# EAGLE design hc_05 (EAGLE 9.6.1)
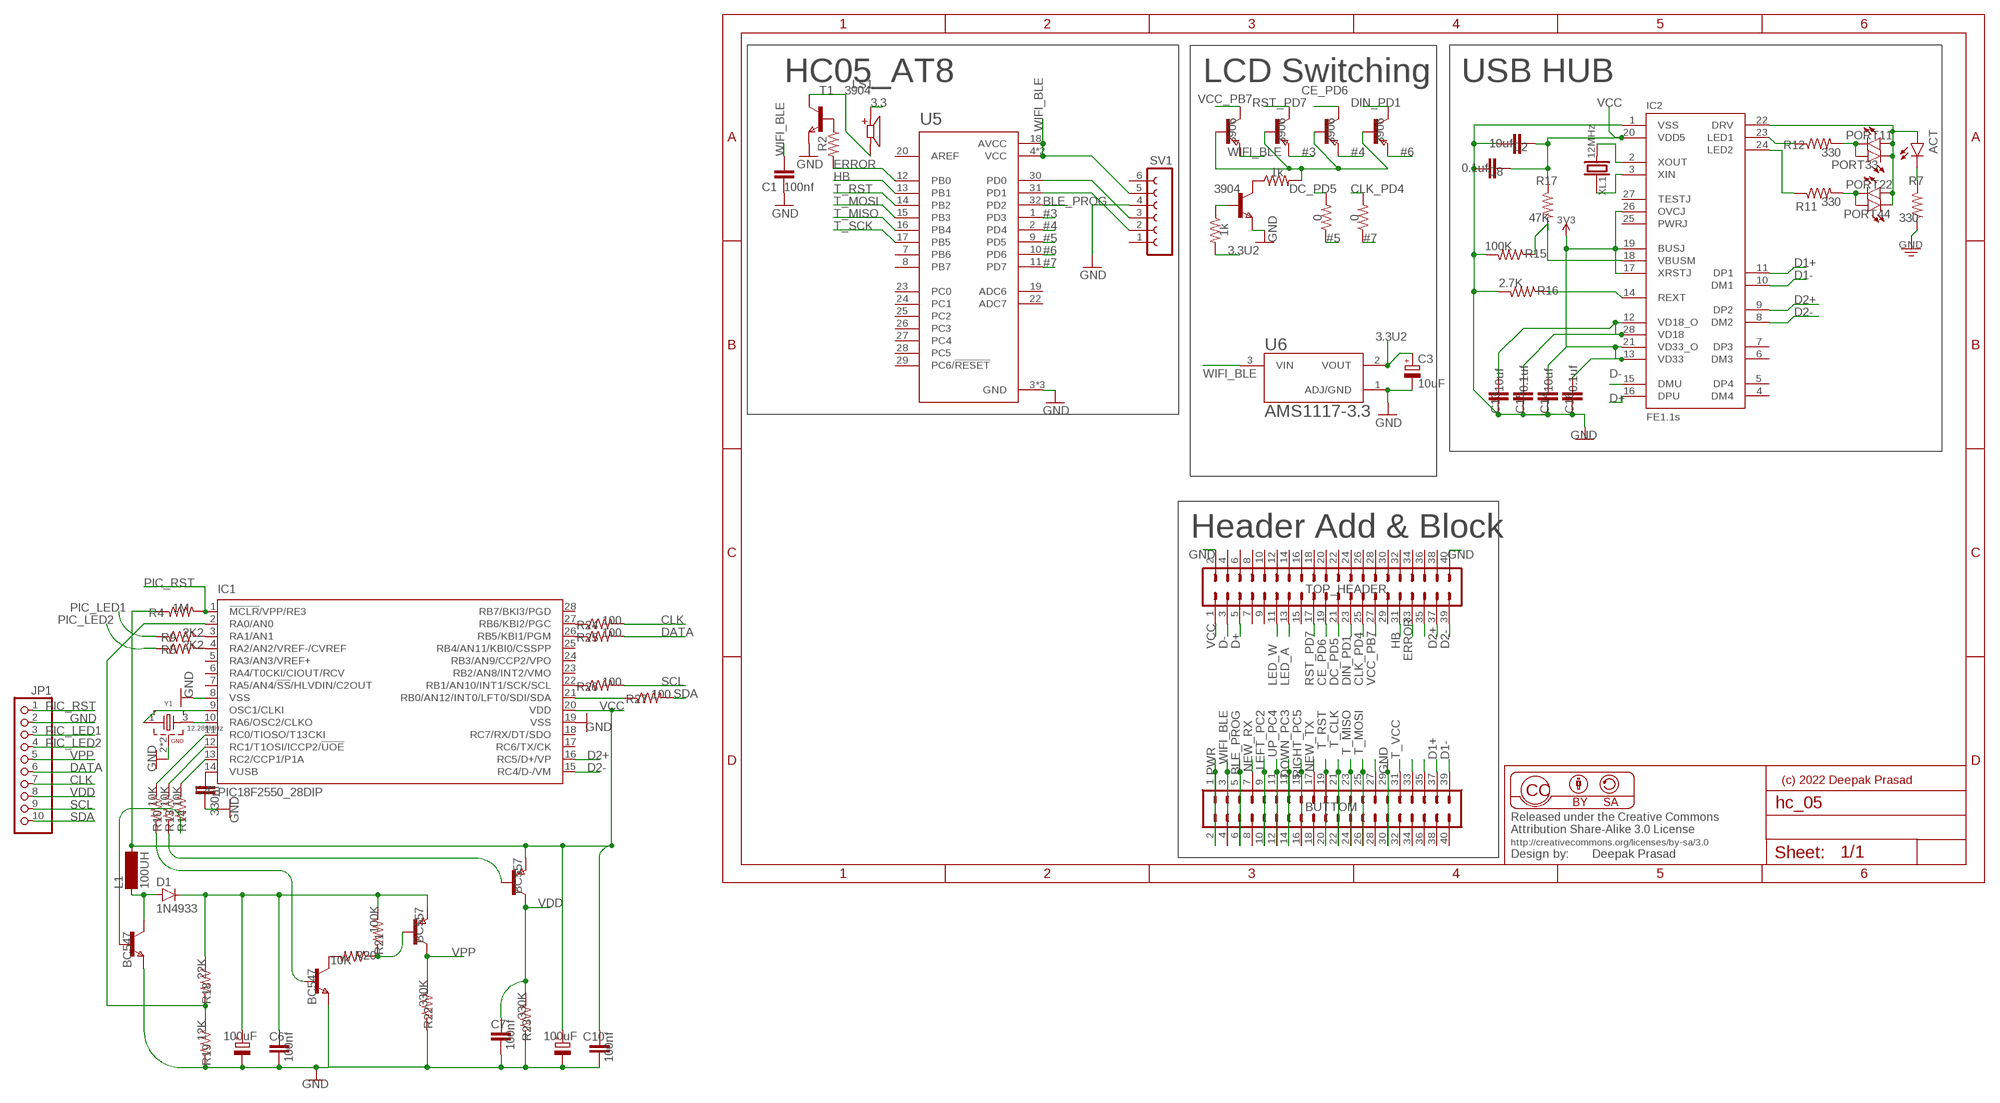
[diagram p0: schematic, sheet 1]

## Parts
ACT  LED1206  [LED-1206]
BUTTOM  MA20-2  [MA20-2]
C1  100nf  C-EUC1206  [C1206]
C2  10uf  C-EUC1206  [C1206]
C3  10uF  CPOL-EUC/6032-28R  [C/6032-28R]
C4  330nf  C-EUC1206  [C1206]
C5  100uF  CPOL-EUC/6032-28R  [C/6032-28R]
C6  100nf  C-EUC1206  [C1206]
C7  100nf  C-EUC1206  [C1206]
C8  0.1uf  C-EUC1206  [C1206]
C9  100uF  CPOL-EUC/6032-28R  [C/6032-28R]
C10  100nf  C-EUC1206  [C1206]
C13  10uf  C-EUC1206  [C1206]
C14  10uf  C-EUC1206  [C1206]
C15  0.1uf  C-EUC1206  [C1206]
C16  0.1uf  C-EUC1206  [C1206]
D1  1N4933  D-SMB  [SMB]
IC1  PIC18F2550_28DIP  [DIL28-3]
IC2  FE1.1S  [FE1.1S_SSOP-28]
JP1  PINHD-1X10  [1X10]
L1  100UH  MS85  [MS85]
LS1  CMT-8530S-SMT  [CUI_CMT-8530S-SMT]
PORT11  LED1206  [LED-1206]
PORT22  LED1206  [LED-1206]
PORT33  LED1206  [LED-1206]
PORT44  LED1206  [LED-1206]
R1  1k  R-US_CHIP-1206(3216-METRIC)  [RESC3216X70]
R2  22  R-US_CHIP-1206(3216-METRIC)  [RESC3216X70]
R3  0  R-US_CHIP-1206(3216-METRIC)  [RESC3216X70]
R4  1M  R-US_CHIP-1206(3216-METRIC)  [RESC3216X70]
R5  2K2  R-US_CHIP-1206(3216-METRIC)  [RESC3216X70]
R6  1k  R-US_CHIP-1206(3216-METRIC)  [RESC3216X70]
R7  330  R-US_CHIP-1206(3216-METRIC)  [RESC3216X70]
R8  0  R-US_CHIP-1206(3216-METRIC)  [RESC3216X70]
R9  2K2  R-US_CHIP-1206(3216-METRIC)  [RESC3216X70]
R10  10K  R-US_CHIP-1206(3216-METRIC)  [RESC3216X70]
R11  330  R-US_CHIP-1206(3216-METRIC)  [RESC3216X70]
R12  330  R-US_CHIP-1206(3216-METRIC)  [RESC3216X70]
R13  10K  R-US_CHIP-1206(3216-METRIC)  [RESC3216X70]
R14  10K  R-US_CHIP-1206(3216-METRIC)  [RESC3216X70]
R15  100K  R-US_CHIP-1206(3216-METRIC)  [RESC3216X70]
R16  2.7K  R-US_CHIP-1206(3216-METRIC)  [RESC3216X70]
R17  47K  R-US_CHIP-1206(3216-METRIC)  [RESC3216X70]
R18  22K  R-US_CHIP-1206(3216-METRIC)  [RESC3216X70]
R19  12K  R-US_CHIP-1206(3216-METRIC)  [RESC3216X70]
R20  10K  R-US_CHIP-1206(3216-METRIC)  [RESC3216X70]
R21  100K  R-US_CHIP-1206(3216-METRIC)  [RESC3216X70]
R22  330K  R-US_CHIP-1206(3216-METRIC)  [RESC3216X70]
R23  330K  R-US_CHIP-1206(3216-METRIC)  [RESC3216X70]
R24  100  R-US_CHIP-1206(3216-METRIC)  [RESC3216X70]
R25  100  R-US_CHIP-1206(3216-METRIC)  [RESC3216X70]
R26  100  R-US_CHIP-1206(3216-METRIC)  [RESC3216X70]
R27  100  R-US_CHIP-1206(3216-METRIC)  [RESC3216X70]
SV1  FE06-1  [FE06]
T1  3904  NPNSOT23  [SOT-23]
T2  3904  NPNSOT23  [SOT-23]
T3  3906  PNPSOT23  [SOT-23]
T4  3906  PNPSOT23  [SOT-23]
T5  3906  PNPSOT23  [SOT-23]
T6  3906  PNPSOT23  [SOT-23]
T7  BC547  NPNSOT23  [SOT-23]
T8  BC557  PNPSOT23  [SOT-23]
T9  BC547  NPNSOT23  [SOT-23]
T10  BC557  PNPSOT23  [SOT-23]
TOP_HEADER  MA20-2  [MA20-2]
U5  ATMEGA328P-AU  [QFP80P900X900X120-32N]
U6  AMS1117-3.3  [SOT229P700X180-4N]
XL1  12MHz  CRYSTALHC49UP  [HC49UP]
Y1  12.288MHz  WE-XTAL_CFPX-104_830059523  [WE-XTAL_CFPX-104]

## Nets
3.3: LS1.P
3.3U2: C3.+ R6.2 U6.2(VOUT)
3V3: C14.2 C16.2 IC2.13(VD33) IC2.17(XRSTJ) IC2.19(BUSJ) IC2.21(VD33_O) IC2.26(OVCJ)
#3: T4.2(E) U5.1(PD3)
#4: T5.2(E) U5.2(PD4)
#5: R8.1 U5.9(PD5)
#6: T6.2(E) U5.10(PD6)
#7: R3.1 U5.11(PD7)
BLE_PROG: BUTTOM.5 BUTTOM.6 U5.32(PD2)
CE_PD6: T5.1(C) TOP_HEADER.19
CLK: JP1.7 R24.2
CLK_PD4: R3.2 TOP_HEADER.25
D1+: BUTTOM.37 IC2.11(DP1)
D1-: BUTTOM.39 IC2.10(DM1)
D2+: IC1.16(RC5/D+/VP) IC2.9(DP2) TOP_HEADER.37
D2-: IC1.15(RC4/D-/VM) IC2.8(DM2) TOP_HEADER.39
D+: IC2.16(DPU) TOP_HEADER.5
D-: IC2.15(DMU) TOP_HEADER.3
DATA: JP1.6 R25.2
DC_PD5: R8.2 TOP_HEADER.21
DIN_PD1: T6.1(C) TOP_HEADER.23
DOWN_PC3: BUTTOM.13 BUTTOM.14
ERROR: R2.2 TOP_HEADER.33 U5.12(PB0)
GND [POWER]: BUTTOM.29 BUTTOM.30 C1.1 C2.2 C3.- C4.1 C5.- C6.1 C7.1 C8.2 C9.- C10.1 C13.1 C14.1 C15.1 C16.1 IC1.8(VSS) IC1.19(VSS) IC2.1(VSS) JP1.2 R7.2 R15.2 R16.2 R19.1 R22.1 R23.1 SV1.4 T1.2(E) T2.2(E) T7.2(E) T9.2(E) TOP_HEADER.2 TOP_HEADER.40 U5.3(GND) U5.5(GND) U5.21(GND) U6.1(ADJ/GND) Y1.2(GND) Y1.4(GND)
HB: TOP_HEADER.31 U5.13(PB1)
LED_A: TOP_HEADER.13
LED_W: TOP_HEADER.11
LEFT_PC2: BUTTOM.9 BUTTOM.10
N$1: R1.1 T2.1(C)
N$2: R1.2 T3.3(B) T4.3(B) T5.3(B) T6.3(B)
N$3: IC1.27(RB6/KBI2/PGC) R24.1
N$4: R2.1 T1.3(B)
N$5: IC1.4(RA2/AN2/VREF-/CVREF) R5.2
N$6: IC1.3(RA1/AN1) R9.2
N$7: IC1.9(OSC1/CLKI) Y1.1
N$8: IC1.10(RA6/OSC2/CLKO) Y1.3
N$9: IC1.11(RC0/TIOSO/T13CKI) R10.2
N$10: IC1.12(RC1/T1OSI/ICCP2/!UOE) R13.2
N$11: IC1.13(RC2/CCP1/P1A) R14.2
N$12: C4.2 IC1.14(VUSB)
N$13: R10.1 T9.3(B)
N$14: SV1.2 U5.31(PD1)
N$15: SV1.3 U5.30(PD0)
N$16: R6.1 T2.3(B)
N$17: IC2.14(REXT) R16.1
N$18: ACT.C R7.1
N$19: D1.2(A) L1.1 T7.1(C)
N$20: C13.2 C15.2 IC2.12(VD18_O) IC2.28(VD18)
N$21: C5.+ C6.2 D1.1(C) R18.2 R21.2 T10.2(E)
N$22: R14.1 T7.3(B)
N$23: LS1.N T1.1(C)
N$24: IC2.23(LED1) R12.1
N$25: IC2.2(XOUT) XL1.2
N$26: IC2.3(XIN) XL1.1
N$27: PORT11.C PORT33.A R12.2
N$28: PORT22.C PORT44.A R11.2
N$29: IC1.2(RA0/AN0) R18.1 R19.2
N$30: R13.1 T8.3(B)
N$31: R20.2 T9.1(C)
N$32: TOP_HEADER.35
N$33: R20.1 R21.1 T10.3(B)
N$34: IC1.26(RB5/KBI1/PGM) R25.1
N$35: IC1.22(RB1/AN10/INT1/SCK/SCL) R26.1
N$36: IC1.21(RB0/AN12/INT0/LFT0/SDI/SDA) R27.1
N$38: IC2.18(VBUSM) R15.1 R17.2
N$41: BUTTOM.27
N$44: BUTTOM.33
N$45: BUTTOM.35
N$48: IC2.24(LED2) R11.1
N$49: ACT.A IC2.22(DRV) PORT11.A PORT22.A PORT33.C PORT44.C
NEW_RX: BUTTOM.7
NEW_TX: BUTTOM.17
PIC_LED1: JP1.3 R9.1
PIC_LED2: JP1.4 R5.1
PIC_RST: IC1.1(!MCLR!/VPP/RE3) JP1.1 R4.2
PWR: BUTTOM.1 BUTTOM.2
RIGHT_PC5: BUTTOM.15 BUTTOM.16
RST_PD7: T4.1(C) TOP_HEADER.17
SCL: JP1.9 R26.2
SDA: JP1.10 R27.2
T_CLK: BUTTOM.21 BUTTOM.22
T_MISO: BUTTOM.23 BUTTOM.24 U5.16(PB4)
T_MOSI: BUTTOM.25 BUTTOM.26 U5.15(PB3)
T_RST: BUTTOM.19 BUTTOM.20 U5.14(PB2)
T_SCK: U5.17(PB5)
T_VCC: BUTTOM.31
UP_PC4: BUTTOM.11 BUTTOM.12
VCC [POWER]: C2.1 C8.1 C9.+ C10.2 IC1.20(VDD) IC2.20(VDD5) L1.2 R4.1 R17.1 T8.2(E) TOP_HEADER.1
VCC_PB7: T3.1(C) TOP_HEADER.27
VDD: C7.2 JP1.8 R23.2 T8.1(C)
VPP: JP1.5 R22.2 T10.1(C)
WIFI_BLE: BUTTOM.3 BUTTOM.4 C1.2 SV1.5 T3.2(E) U5.4(VCC) U5.6(VCC) U5.18(AVCC) U6.3(VIN)
Unconnected: BUTTOM.8 BUTTOM.18 BUTTOM.28 BUTTOM.32 BUTTOM.34 BUTTOM.36 BUTTOM.38 BUTTOM.40 IC1.5(RA3/AN3/VREF+) IC1.6(RA4/T0CKI/CIOUT/RCV) IC1.7(RA5/AN4/!SS!/HLVDIN/C2OUT) IC1.17(RC6/TX/CK) IC1.18(RC7/RX/DT/SDO) IC1.23(RB2/AN8/INT2/VMO) IC1.24(RB3/AN9/CCP2/VPO) IC1.25(RB4/AN11/KBI0/CSSPP) IC1.28(RB7/BKI3/PGD) IC2.4(DM4) IC2.5(DP4) IC2.6(DM3) IC2.7(DP3) IC2.25(PWRJ) IC2.27(TESTJ) SV1.1 SV1.6 TOP_HEADER.4 TOP_HEADER.6 TOP_HEADER.7 TOP_HEADER.8 TOP_HEADER.9 TOP_HEADER.10 TOP_HEADER.12 TOP_HEADER.14 TOP_HEADER.15 TOP_HEADER.16 TOP_HEADER.18 TOP_HEADER.20 TOP_HEADER.22 TOP_HEADER.24 TOP_HEADER.26 TOP_HEADER.28 TOP_HEADER.29 TOP_HEADER.30 TOP_HEADER.32 TOP_HEADER.34 TOP_HEADER.36 TOP_HEADER.38 U5.7(PB6) U5.8(PB7) U5.19(ADC6) U5.20(AREF) U5.22(ADC7) U5.23(PC0) U5.24(PC1) U5.25(PC2) U5.26(PC3) U5.27(PC4) U5.28(PC5) U5.29(PC6/!RESET)

## Notes on the sheet
- HC05_AT8 | LCD Switching | USB HUB
- Header Add & Block
- (c) 2022 Deepak Prasad

## Library data of the parts
ACT PORT11 PORT22 PORT33 PORT44 = SparkFun-LED:LED: LED (Generic) Standard schematic elements and footprints for 5mm, 3mm, 1206, and 0603 sized LEDs. Generic LEDs with no color specified.
BUTTOM TOP_HEADER = con-lstb:MA20-2: PIN HEADER; OC_FARNELL: unknown; OC_NEWARK: unknown
C1 C2 C4 C6-C8 C10 C13-C16 = rcl:C-EU: CAPACITOR, European symbol; SPICEPREFIX: C
C3 C5 C9 = rcl:CPOL-EU: POLARIZED CAPACITOR, European symbol
D1 = semicon-smd-ipc:D-: DIODE unfilled
IC1 = microchip:PIC18F2*_28: USB Microcontrollers with nanoWatt Technology High-Performance, Enhanced Flash, 28/40/44-Pin, Source: http://ww1.microchip.com/downloads/en/devicedoc/39632c.pdf; MF: MICROCHIP; MPN: PIC18F2550-I/SP; OC_FARNELL: 1523822; OC_NEWARK: 80K6054
IC2 = Ai_IC:FE1.1S
JP1 = pinhead:PINHD-1X10: PIN HEADER
L1 = inductor-neosid:MS85: INDUCTOR SMD power inductor; OC_FARNELL: unknown; OC_NEWARK: unknown
LS1 = CMT-8530S-SMT:CMT-8530S-SMT: 8.5 mm, 3.6 Vo-p, 90 dB, Surface Mount (SMT), Magnetic Audio Transducer Buzzer Check availability <https://pricing.snapeda.com/parts/CMT-8530S-SMT-TR/CUI%20Devices/view-part?ref=eda>; AVAILABILITY: In Stock; CUI_PURCHASE_URL: https://www.cuidevices.com/product/audio/buzzers/audio-transducers/cmt-8530s-smt-tr?utm_source=snapeda.com&utm_medium=referral&utm_campaign=snapedaBOM; DESCRIPTION: 8.5 mm, 3.6 Vo-p, 90 dB, Surface Mount (SMT), Magnetic Audio Transducer Buzzer; MF: CUI Devices; MP: CMT-8530S-SMT-TR; PACKAGE: None; PRICE: None; PURCHASE-URL: https://pricing.snapeda.com/search/part/CMT-8530S-SMT-TR/?ref=eda
R1-R27 = Resistor:R-US: Resistor Fixed - ANSI; CATEGORY: Resistor; SUB-CATEGORY: Fixed
SV1 = con-lsta:FE06-1: FEMALE HEADER; OC_FARNELL: unknown; OC_NEWARK: unknown
T1 T2 T7 T9 = zetex:NPNSOT23: NPN TRANSISTOR; MPN: DSS20201L-7; OC_FARNELL: 1710688; OC_NEWARK: 25R4555
T3-T6 T8 T10 = zetex:PNPSOT23: PNP TRANSISTOR; MPN: DSS20200L-7; OC_FARNELL: unknown; OC_NEWARK: 25R4554
U5 = ATMEGA328P-AU:ATMEGA328P-AU: ATmega Series 20 MHz 32 KB Flash 2 KB SRAM 8-Bit Microcontroller - TQFP-32 Check availability <https://pricing.snapeda.com/parts/ATMEGA328P-AU/Microchip%20Technology/view-part?ref=eda>; AVAILABILITY: In Stock; DESCRIPTION: AVR AVR® ATmega Microcontroller IC 8-Bit 20MHz 32KB (16K x 16) FLASH 32-TQFP (7x7); MF: Microchip Technology; MP: ATMEGA328P-AU; PACKAGE: TQFP-32 Microchip; PRICE: None; PURCHASE-URL: https://pricing.snapeda.com/search/part/ATMEGA328P-AU/?ref=eda
U6 = AMS1117-3.3:AMS1117-3.3: Sot223/Pkg 1-Amp 3.3-Volt Low Drop Out Voltage Regulatator Check availability <https://pricing.snapeda.com/parts/AMS1117-3.3/Advanced%20Monolithic%20Systems/view-part?ref=eda>; AVAILABILITY: In Stock; DESCRIPTION: Sot223/Pkg 1-Amp 3.3-Volt Low Drop Out Voltage Regulatator; MF: Advanced Monolithic Systems; MP: AMS1117-3.3; PACKAGE: SOT-223 Seeed Technology; PRICE: None
XL1 = Ai_FrequencyControl:CRYSTAL: PTH: ... SMD: ... Cylinder: CMR200T-32.768KDZBT
Y1 = Wurth_Quartz Crystals & Oscillators_WE-XTAL:WE-XTAL_CFPX-104: WE-XTAL Quartz Crystal Characteristics SMT and THT models Hermetically sealed Frequencies between 1.8432 MHz and 50 MHz Tolerances down to ±10 ppm available Maximum operating temperatures range: -40 °C to 85 °C Stabilities down to ±10 ppm available Applications Microprocessor Wireless Communication Devices Industrial Devices Wired Communication (e.g. Ethernet and USB) IoT Optical Network Audio and Multimedia Devices Test and Measurement Equipment Navigation and Locators Wearables <https://www.we-online.com/catalog/media/o135919v209%20Family_WE-XTAL_IQXC-42.jpg> Details see: https://www.we-online.com/catalog/en/WE-XTAL Updated by Ella Wu , 2020-11-23 2020 (C) Wurth Elektronik; C-LOAD: 18pF; DATASHEET-URL: https://www.we-online.com/catalog/datasheet/830059523.pdf; MOUNT: SMT; PART-NUMBER: 830059523; STABILITY: 30ppm; TOLERANCE: ±20ppm

## Net classes
0 default: width 0.254 mm, clearance 0.254 mm
1 POWER: width 0.254 mm, clearance 0.254 mm

## Board
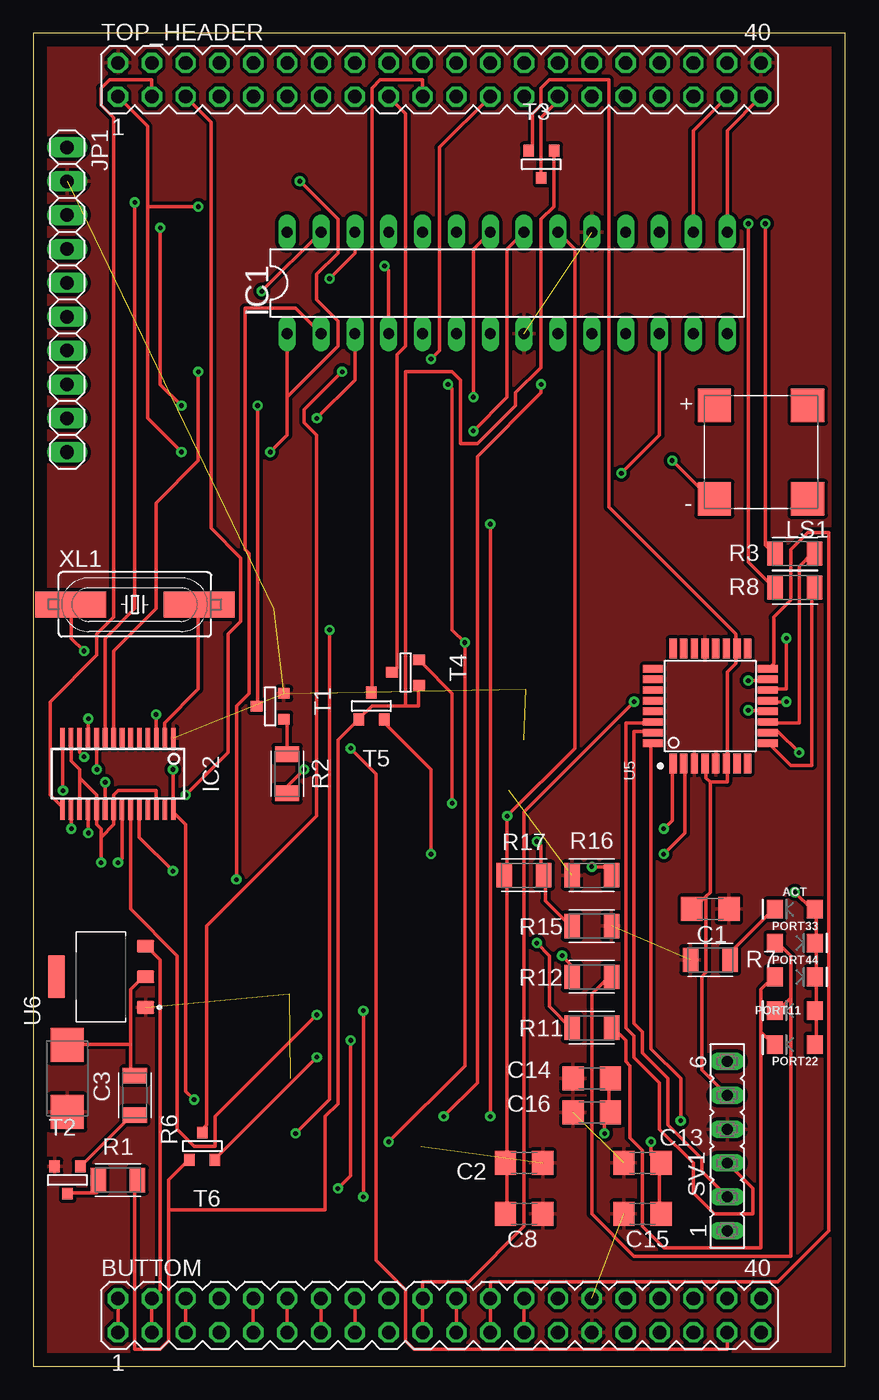
[diagram p1: board, top side]
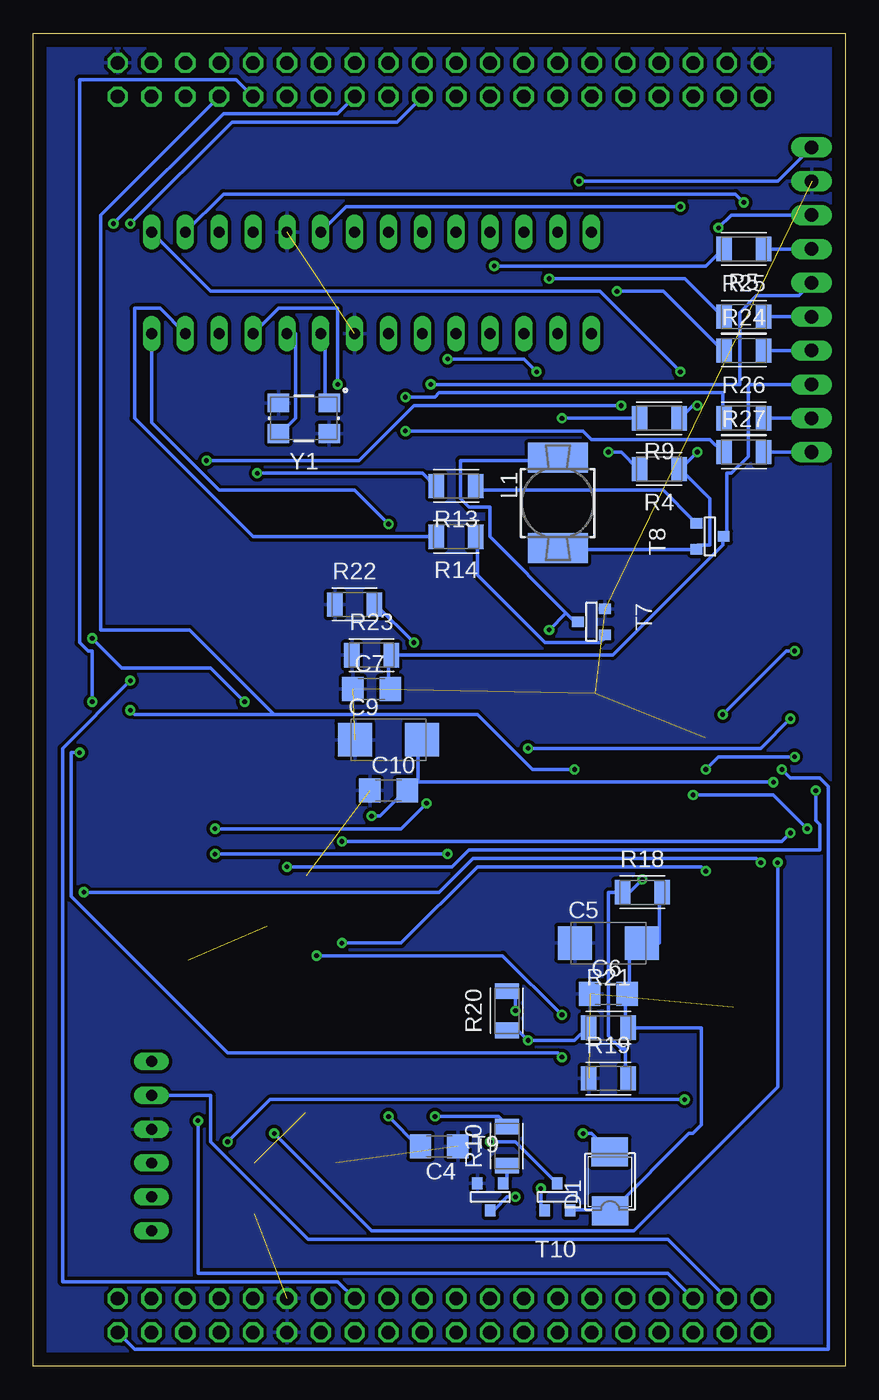
[diagram p2: board, bottom side, seen from below]

Size 60.94 x 100 mm. Coordinates in mm from the lower left corner, seen from the top.
Outline: 0,0 60.94,0 60.94,100 0,100 0,0
Copper layers (1*16): Top 0.035mm / dielectric 1.5mm / Bottom 0.035mm
Design rules "default": minimum track width 6mil, minimum drill 0.35mm, track to track 6mil, track to pad 6mil, pad to pad 6mil, via to via 6mil, smd to smd 6mil, copper to edge 40mil, drill to drill 6mil, minimum pad ring 10mil, minimum via ring 8mil, stop-mask expansion 4mil, vias tented up to drill 0mil, thermal gap 10mil

### Footprints (pad centres in the part's own frame; a part is rotated, then mirrored left to right if it is on the bottom)
LED-1206 = smd 1.2 x 1.4: A -1.5,0; C 1.5,0
MA20-2 = drill 1.016 octagon: 1 -24.13,-1.27; 2 -24.13,1.27; 3 -21.59,-1.27; 4 -21.59,1.27; 5 -19.05,-1.27; 6 -19.05,1.27; 7 -16.51,-1.27; 8 -16.51,1.27; 9 -13.97,-1.27; 10 -13.97,1.27; 11 -11.43,-1.27; 12 -11.43,1.27; 13 -8.89,-1.27; 14 -8.89,1.27; 15 -6.35,-1.27; 16 -6.35,1.27; 17 -3.81,-1.27; 18 -3.81,1.27; 19 -1.27,-1.27; 20 -1.27,1.27; 21 1.27,-1.27; 22 1.27,1.27; 23 3.81,-1.27; 24 3.81,1.27; 25 6.35,-1.27; 26 6.35,1.27; 27 8.89,-1.27; 28 8.89,1.27; 29 11.43,-1.27; 30 11.43,1.27; 31 13.97,-1.27; 32 13.97,1.27; 33 16.51,-1.27; 34 16.51,1.27; 35 19.05,-1.27; 36 19.05,1.27; 37 21.59,-1.27; 38 21.59,1.27; 39 24.13,-1.27; 40 24.13,1.27
C1206 = smd 1.6 x 1.8: 1 -1.4,0; 2 1.4,0
C/6032-28R = smd 2.55 x 2.5: + 2.525,0; - -2.525,0
SMB = smd 2.159 x 2.743: 1 -2.311,-0.127; 2 2.108,-0.102
DIL28-3 = drill 0.813 long: 1 -16.51,-3.81; 2 -13.97,-3.81; 3 -11.43,-3.81; 4 -8.89,-3.81; 5 -6.35,-3.81; 6 -3.81,-3.81; 7 -1.27,-3.81; 8 1.27,-3.81; 9 3.81,-3.81; 10 6.35,-3.81; 11 8.89,-3.81; 12 11.43,-3.81; 13 13.97,-3.81; 14 16.51,-3.81; 15 16.51,3.81; 16 13.97,3.81; 17 11.43,3.81; 18 8.89,3.81; 19 6.35,3.81; 20 3.81,3.81; 21 1.27,3.81; 22 -1.27,3.81; 23 -3.81,3.81; 24 -6.35,3.81; 25 -8.89,3.81; 26 -11.43,3.81; 27 -13.97,3.81; 28 -16.51,3.81
FE1.1S_SSOP-28 = smd 0.35 x 1.5: 1 -4.16,-2.7; 2 -3.52,-2.7; 3 -2.88,-2.7; 4 -2.24,-2.7; 5 -1.6,-2.7; 6 -0.96,-2.7; 7 -0.32,-2.7; 8 0.32,-2.7; 9 0.96,-2.7; 10 1.6,-2.7; 11 2.24,-2.7; 12 2.88,-2.7; 13 3.52,-2.7; 14 4.16,-2.7; 15 4.16,2.7; 16 3.52,2.7; 17 2.88,2.7; 18 2.24,2.7; 19 1.6,2.7; 20 0.96,2.7; 21 0.32,2.7; 22 -0.3,2.7; 23 -0.96,2.7; 24 -1.6,2.7; 25 -2.24,2.7; 26 -2.88,2.7; 27 -3.52,2.7; 28 -4.16,2.7
1X10 = drill 1.016 long: 1 -11.43,0; 2 -8.89,0; 3 -6.35,0; 4 -3.81,0; 5 -1.27,0; 6 1.27,0; 7 3.81,0; 8 6.35,0; 9 8.89,0; 10 11.43,0
MS85 = smd 4.5 x 2.25: 1 0,-3.383; 2 0,3.383
CUI_CMT-8530S-SMT = smd 2.5 x 2.5: 1 -3.5,3.5; 2 -3.5,-3.5; N 3.5,3.5; P 3.5,-3.5
RESC3216X70 = smd 1.165 x 1.815: 1 -1.475,0; 2 1.475,0
FE06 = drill 0.813 long: 1 -6.35,0; 2 -3.81,0; 3 -1.27,0; 4 1.27,0; 5 3.81,0; 6 6.35,0
SOT-23 = smd 0.787 x 0.889: 1 0.025,-1.016; 2 -0.94,1.016; 3 0.991,1.016
QFP80P900X900X120-32N = smd 1.5 x 0.55: 1 -4.3,2.8; 2 -4.3,2; 3 -4.3,1.2; 4 -4.3,0.4; 5 -4.3,-0.4; 6 -4.3,-1.2; 7 -4.3,-2; 8 -4.3,-2.8; 17 4.3,-2.8; 18 4.3,-2; 19 4.3,-1.2; 20 4.3,-0.4; 21 4.3,0.4; 22 4.3,1.2; 23 4.3,2; 24 4.3,2.8 | smd 0.55 x 1.5: 9 -2.8,-4.3; 10 -2,-4.3; 11 -1.2,-4.3; 12 -0.4,-4.3; 13 0.4,-4.3; 14 1.2,-4.3; 15 2,-4.3; 16 2.8,-4.3; 25 2.8,4.3; 26 2,4.3; 27 1.2,4.3; 28 0.4,4.3; 29 -0.4,4.3; 30 -1.2,4.3; 31 -2,4.3; 32 -2.8,4.3
SOT229P700X180-4N = smd 0.93 x 1.31: 1 -2.29,-3.345; 2 0,-3.345; 3 2.29,-3.345 | smd 3.24 x 1.31: 4 0,3.345
HC49UP = smd 5.334 x 1.93: 1 -4.826,0; 2 4.826,0
WE-XTAL_CFPX-104 = smd 1.6 x 1.4: 1 -1.9,-1.15; 2 1.9,-1.15; 3 1.9,1.15; 4 -1.9,1.15

### Placement (x,y rotation side)
ACT  57.15,34.29 180 top
BUTTOM  30.48,3.81 0 top
C1  50.8,34.29 180 top
C2  36.83,15.24 0 top
C3  2.54,21.59 90 top
C4  30.48,16.51 180 bottom
C5  17.78,31.75 0 bottom
C6  17.78,27.94 0 bottom
C7  35.56,50.8 0 bottom
C8  36.83,11.43 0 top
C9  34.29,46.99 0 bottom
C10  34.29,43.18 0 bottom
C13  45.72,15.24 0 top
C14  41.91,21.59 0 top
C15  45.72,11.43 0 top
C16  41.91,19.05 0 top
D1  17.78,13.97 90 bottom
IC1  35.56,81.28 0 top
IC2  6.35,44.45 180 top
JP1  2.54,80.01 270 top
L1  21.59,64.77 180 bottom
LS1  54.61,68.58 180 top
PORT11  57.15,26.67 180 top
PORT22  57.15,24.13 180 top
PORT33  57.15,31.75 0 top
PORT44  57.15,29.21 0 top
R1  6.35,13.97 0 top
R2  19.05,44.45 270 top
R3  57.15,60.96 180 top
R4  13.97,67.31 180 bottom
R5  7.62,83.82 180 bottom
R6  7.62,20.32 90 top
R7  50.8,30.48 180 top
R8  57.15,58.42 180 top
R9  13.97,71.12 180 bottom
R10  25.4,16.51 90 bottom
R11  41.91,25.4 0 top
R12  41.91,29.21 0 top
R13  29.21,66.04 180 bottom
R14  29.21,62.23 180 bottom
R15  41.91,33.02 0 top
R16  41.91,36.83 180 top
R17  36.83,36.83 0 top
R18  15.24,35.56 0 bottom
R19  17.78,21.59 0 bottom
R20  25.4,26.67 90 bottom
R21  17.78,25.4 0 bottom
R22  36.83,57.15 0 bottom
R23  35.56,53.34 0 bottom
R24  7.62,76.2 0 bottom
R25  7.62,78.74 0 bottom
R26  7.62,71.12 0 bottom
R27  7.62,68.58 0 bottom
SV1  52.07,16.51 90 top
T1  17.78,49.53 270 top
T2  2.54,13.97 0 top
T3  38.1,90.17 0 top
T4  27.94,52.07 270 top
T5  25.4,49.53 180 top
T6  12.7,16.51 180 top
T7  19.05,55.88 270 bottom
T8  10.16,62.23 90 bottom
T9  26.67,12.7 0 bottom
T10  21.59,12.7 180 bottom
TOP_HEADER  30.48,96.52 0 top
U5  50.8,49.53 90 top
U6  5.08,29.21 90 top
XL1  7.62,57.15 0 top
Y1  40.64,71.12 180 bottom

### Tracks (layer width: path | path; a pad name or v marks a point on that pad's centre or on a via)
3.3U2
  Top 0.254: 7.3,24.13 7.3,22.23 7.62,21.91 R6.2 | 7.3,24.13 7.3,28.26 8.26,29.21 U6.2 | 7.3,24.13 2.54,24.13 C3.+
3V3  (via drill 0.35)
  Top 0.254: IC2.26 9.21,41.91 9.21,43.18 6.35,43.18 6.03,42.86 6.03,41.91 IC2.21 6.03,41.59 6.03,40.64 5.08,39.69 | 43.18,19.05 43.18,21.59 C14.2 | 3.49,44.13 3.49,44.77 2.86,45.4 2.86,46.99 IC2.13 | 3.49,44.13 3.49,41.91 IC2.17 | 3.49,44.13 4.76,42.86 4.76,41.91 IC2.19 4.76,41.59 4.76,40.64 5.08,40.32 5.08,39.69 | 43.18,19.05 42.86,18.73 v42.86,17.46 | 5.08,39.69 v5.08,37.78 | 43.18,19.05 C16.2
  Bottom 0.254: v42.86,17.46 35.56,10.16 15.88,10.16 5.08,20.95 v5.08,37.78
#3  (via drill 0.35)
  Top 0.254: v31.43,42.23 31.43,50.48 29.21,52.7 T4.2 | v47.31,40.32 47.94,40.96 47.94,45.09 U5.1
  Bottom 0.254: v31.43,42.23 33.34,40.32 v47.31,40.32
#4  (via drill 0.35)
  Top 0.254: v29.84,38.42 29.84,44.77 26.35,48.26 T5.2 | v47.31,38.42 48.9,40.01 48.9,45.09 U5.2
  Bottom 0.254: v47.31,38.42 v29.84,38.42
#5
  Top 0.254: U5.9 55.24,46.67 56.83,45.09 58.42,45.09 58.42,58.42 R8.1
#6  (via drill 0.35)
  Top 0.254: v21.27,23.18 13.65,15.56 T6.2 | v57.47,46.04 55.88,47.62 55.24,47.62 U5.10
  Bottom 0.254: v21.27,23.18 21.59,23.5 46.35,23.5 58.1,35.24 58.1,46.04 v57.47,46.04
#7
  Top 0.254: U5.11 55.24,48.26 57.47,48.26 57.47,60.01 58.42,60.96 R3.1
BLE_PROG  (via drill 0.35)
  Top 0.254: v48.58,18.41 48.58,21.59 46.35,23.81 46.35,46.67 U5.32 | BUTTOM.6 BUTTOM.5
  Bottom 0.254: v48.58,18.41 48.58,6.99 13.34,6.99 BUTTOM.6
CE_PD6
  Top 0.254: TOP_HEADER.19 29.21,96.52 26.04,96.52 25.4,95.89 25.4,50.8 T5.1
CLK
  Bottom 0.254: JP1.7 R24.2
CLK_PD4  (via drill 0.35)
  Top 0.254: v54.93,85.72 54.93,61.59 55.56,60.96 R3.2
  Bottom 0.254: v54.93,85.72 46.67,93.98 38.1,93.98 TOP_HEADER.25
D1+  (via drill 0.35)
  Top 0.254: v4.13,48.58 4.13,47.31 IC2.11 | v23.81,46.35 25.72,44.45 25.72,7.94 27.94,5.71 27.94,1.91 28.57,1.27 52.07,1.27 BUTTOM.37
  Bottom 0.254: v4.13,48.58 6.35,46.35 v23.81,46.35
D1-  (via drill 0.35)
  Top 0.254: v4.76,44.77 4.76,46.99 IC2.10
  Bottom 0.254: v4.76,44.77 4.13,44.13 1.91,44.13 1.27,43.5 1.27,1.27 53.34,1.27 BUTTOM.39
D2+  (via drill 0.35)
  Top 0.254: v7.62,87.31 7.62,56.83 5.4,54.61 5.4,47.31 IC2.9 | TOP_HEADER.37 49.53,92.71 IC1.16
  Bottom 0.254: v7.62,87.31 8.26,87.95 46.67,87.95 IC1.16
D2-  (via drill 0.35)
  Top 0.254: v12.38,74.61 12.38,67.94 9.21,64.77 9.21,56.83 6.03,53.66 6.03,47.31 IC2.8 | TOP_HEADER.39 52.07,92.71 IC1.15
  Bottom 0.254: v12.38,74.61 18.41,80.64 47.62,80.64 IC1.15
D+  (via drill 0.35)
  Top 0.254: v2.86,40.32 2.86,41.59 IC2.16 | v11.43,42.86 14.61,46.04 14.61,54.93 15.56,55.88 15.56,60.64 13.34,62.87 13.34,93.34 TOP_HEADER.5
  Bottom 0.254: v2.86,40.32 5.4,42.86 v11.43,42.86
D-
  Top 0.254: TOP_HEADER.3 8.89,96.52 5.71,96.52 5.08,95.89 5.08,94.61 6.03,93.66 6.03,56.2 4.76,54.93 4.76,53.34 1.27,49.85 1.27,42.86 2.22,41.91 IC2.15
DATA
  Bottom 0.254: JP1.6 R25.2
DC_PD5  (via drill 0.35)
  Top 0.254: v53.66,85.72 53.66,60.33 55.56,58.42 R8.2
  Bottom 0.254: v53.66,85.72 46.04,93.34 33.66,93.34 TOP_HEADER.21
DIN_PD1  (via drill 0.35)
  Top 0.254: v23.18,74.61 20.32,71.75 20.32,70.8 21.27,69.85 21.27,41.27 13.02,33.02 13.02,18.1 12.7,17.78 T6.1 | v29.84,75.56 30.48,76.2 30.48,91.44 TOP_HEADER.23
  Bottom 0.254: v23.18,74.61 24.13,75.56 v29.84,75.56
DOWN_PC3
  Top 0.254: BUTTOM.14 BUTTOM.13
ERROR  (via drill 0.35)
  Top 0.254: v53.66,49.21 54.93,49.21 U5.12 | v20.32,44.77 19.05,43.5 R2.2
  Bottom 0.254: v53.66,49.21 53.34,48.9 42.86,48.9 | 42.86,48.9 27.62,48.9 23.5,44.77 v20.32,44.77 | TOP_HEADER.33 55.88,86.36 55.88,55.24 49.21,55.24 42.86,48.9
GND  (13 unrouted)
  pour Top (isolate 0.254): 0,100.33 0,0 60.96,0 60.96,99.06 62.23,100.33 1.27,100.33
  pour Bottom (isolate 0.254): 0,100.33 0,0 60.96,0 60.96,100.33
HB  (via drill 0.35)
  Top 0.254: v56.52,49.85 55.24,49.85 U5.13
  Bottom 0.254: v56.52,49.85 56.52,53.66 56.83,53.66 57.47,54.29 57.47,96.52 45.72,96.52 TOP_HEADER.31
LEFT_PC2
  Top 0.254: BUTTOM.10 BUTTOM.9
N$1
  Top 0.254: T2.1 2.86,13.02 4.76,13.02 4.76,13.97 R1.1
N$2
  Top 0.254: 10.16,11.75 10.16,1.91 9.53,1.27 7.62,1.27 7.62,13.97 R1.2 | 10.16,11.75 10.16,13.97 11.43,15.24 T6.3 | 27.94,49.53 28.89,49.53 28.89,50.8 T4.3 | 27.94,49.53 25.4,49.53 24.45,48.58 T5.3 24.13,48.26 22.86,46.99 22.86,19.68 21.91,18.73 21.91,11.75 10.16,11.75 | 27.94,49.53 27.94,74.61 31.43,74.61 32.07,73.98 32.07,69.22 33.34,69.22 36.2,72.07 36.2,73.03 38.1,74.93 38.1,86.04 39.05,87 39.05,91.12 T3.3
N$3  (via drill 0.35)
  Top 0.254: IC1.27 v17.14,80.64
  Bottom 0.254: v17.14,80.64 13.65,80.64 9.21,76.2 R24.1
N$4
  Top 0.254: R2.1 19.05,48.26 T1.3
N$5  (via drill 0.35)
  Top 0.254: v26.35,82.55 26.67,82.23 IC1.4
  Bottom 0.254: v26.35,82.55 10.48,82.55 9.21,83.82 R5.2
N$6  (via drill 0.35)
  Top 0.254: v21.27,71.12 24.13,73.98 IC1.3
  Bottom 0.254: v21.27,71.12 R9.2
N$7
  Bottom 0.254: IC1.9 39.05,77.47 39.05,72.39 Y1.1
N$8
  Bottom 0.254: IC1.10 41.27,77.47 41.27,71.12 42.23,70.17 Y1.3
N$9  (via drill 0.35)
  Top 0.254: v30.8,18.73 33.34,21.27 33.34,68.26 38.1,73.03 v38.1,73.66
  Bottom 0.254: v30.8,18.73 26.04,18.73 25.4,18.1 R10.2 | v38.1,73.66 38.1,79.38 42.55,79.38 IC1.11
N$10  (via drill 0.35)
  Top 0.254: v44.13,66.99 46.99,69.85 IC1.12
  Bottom 0.254: v44.13,66.99 31.75,66.99 30.8,66.04 R13.2
N$11
  Bottom 0.254: R14.2 44.45,62.23 53.34,71.12 53.34,79.38 51.44,79.38 IC1.13
N$12  (via drill 0.35)
  Top 0.254: v34.29,63.18 v34.29,18.73
  Bottom 0.254: v34.29,18.73 32.07,16.51 C4.2 | v34.29,63.18 36.83,65.72 46.99,65.72 52.07,70.8 IC1.14
N$13
  Bottom 0.254: R10.1 25.4,13.97 T9.3
N$14
  Top 0.254: SV1.2 50.16,14.61 50.16,15.56 47.62,18.1 47.62,21.59 45.72,23.5 45.72,25.08 45.09,25.72 45.09,47.62 46.35,47.62 U5.31
N$15
  Top 0.254: SV1.3 53.98,13.34 53.98,11.43 51.12,11.43 49.53,13.02 49.53,15.24 46.99,17.78 46.99,21.27 45.09,23.18 45.09,24.77 44.45,25.4 44.45,48.26 46.35,48.26 U5.30
N$16
  Top 0.254: T2.3 3.81,15.24 7.62,19.05 R6.1
N$17  (via drill 0.35)
  Top 0.254: v2.22,43.18 2.22,46.99 IC2.14 | v41.91,37.47 43.18,37.47 43.18,36.83 R16.1
  Bottom 0.254: v2.22,43.18 2.22,40.96 1.91,40.64 1.91,38.73 28.26,38.73 29.53,37.47 v41.91,37.47
N$18
  Top 0.254: ACT.C 55.56,34.29 52.39,31.11 52.39,30.48 R7.1
N$19  (via drill 0.35)
  Top 0.254: v19.68,17.46 22.23,20 v22.23,55.24
  Bottom 0.254: 20.95,56.52 26.67,62.23 26.67,64.45 28.26,64.45 28.89,65.09 28.89,67.94 21.59,67.94 L1.1 | 20.95,56.52 20.32,55.88 T7.1 | v19.68,17.46 19.05,17.46 17.78,16.19 D1.2 | 20.95,56.52 v22.23,55.24
N$20  (via drill 0.35)
  Top 0.254: 46.99,15.24 46.99,11.43 C15.2 | v10.48,44.77 10.48,41.91 IC2.28 10.48,41.59 11.43,40.64 11.43,20.64 v12.06,20 | v3.81,45.72 3.49,46.04 3.49,46.99 IC2.12 | 46.99,15.24 46.35,15.88 v46.35,16.83 | 46.99,15.24 C13.2
  Bottom 0.254: v10.48,44.77 9.53,45.72 v3.81,45.72 | v46.35,16.83 43.18,20 v12.06,20
N$21
  Bottom 0.254: T10.2 20.64,11.75 17.78,11.75 D1.1 17.46,11.75 11.75,17.46 11.43,17.46 10.79,18.1 10.79,25.4 R21.2 16.51,25.4 16.51,27.94 C6.2 16.19,27.94 16.19,31.75 C5.+ 13.97,31.75 13.97,35.56 R18.2
N$22
  Bottom 0.254: T7.3 18.1,54.61 18.41,54.29 22.54,54.29 27.62,59.37 27.62,62.23 R14.1
N$23  (via drill 0.35)
  Top 0.254: v16.83,72.07 16.83,49.53 T1.1 | v47.94,67.94 50.8,65.09 LS1.N
  Bottom 0.254: v16.83,72.07 32.38,72.07 36.51,67.94 v47.94,67.94
N$24  (via drill 0.35)
  Top 0.254: v21.27,26.35 13.65,18.73 13.65,16.51 12.06,16.51 10.79,17.78 10.79,30.8 7.3,34.29 7.3,41.59 IC2.23 | v39.69,30.8 40.32,30.16 40.32,29.21 R12.1
  Bottom 0.254: v21.27,26.35 25.72,30.8 v39.69,30.8
N$25
  Top 0.254: IC2.2 9.84,47.31 9.84,48.26 12.38,50.8 12.38,57.15 XL1.2
N$26  (via drill 0.35)
  Top 0.254: v9.21,48.9 9.21,47.31 IC2.3 | v3.81,53.66 2.86,54.61 2.86,57.15 XL1.1
  Bottom 0.254: v9.21,48.9 4.45,53.66 v3.81,53.66
N$27
  Top 0.254: 56.83,27.62 55.88,26.67 PORT11.C | 56.83,27.62 56.83,30.8 55.88,31.75 PORT33.A | 56.83,27.62 56.83,8.26 45.09,8.26 41.91,11.43 41.91,27.94 43.18,29.21 R12.2
N$28
  Top 0.254: 54.61,25.08 55.56,24.13 PORT22.C | 54.61,25.08 54.61,28.26 55.56,29.21 PORT44.A | 54.61,25.08 54.61,8.89 47.31,8.89 45.72,10.48 45.72,16.19 44.77,17.14 44.77,22.54 44.45,22.86 44.45,24.45 43.5,25.4 R11.2
N$29  (via drill 0.35)
  Top 0.254: IC1.2 19.68,79.38 15.88,79.38 15.88,61.28 16.19,60.96 16.19,50.48 15.24,49.53 v15.24,36.51
  Bottom 0.254: R19.2 16.51,21.59 16.51,23.81 16.83,23.81 17.78,24.77 17.78,35.56 R18.1 16.19,35.56 v15.24,36.51
N$30
  Bottom 0.254: T8.3 11.43,63.5 13.65,65.72 27.3,65.72 27.62,66.04 R13.1
N$31  (via drill 0.35)
  Top 0.254: v24.77,26.67 v24.77,12.7
  Bottom 0.254: v24.77,12.7 25.4,12.7 26.35,11.75 T9.1 | v24.77,26.67 24.77,27.94 25.4,27.94 R20.2
N$33  (via drill 0.35)
  Top 0.254: v22.86,13.34 23.81,14.29 v23.81,24.45
  Bottom 0.254: v22.86,13.34 22.86,11.75 T10.3 | R20.1 25.4,25.08 24.45,25.08 v23.81,24.45 20.32,24.45 19.37,25.4 R21.1
N$34  (via drill 0.35)
  Top 0.254: v22.23,81.6 24.13,83.5 IC1.26
  Bottom 0.254: v22.23,81.6 12.06,81.6 9.21,78.74 R25.1
N$35  (via drill 0.35)
  Top 0.254: v33.02,72.71 33.02,83.82 IC1.22
  Bottom 0.254: v33.02,72.71 30.8,72.71 30.48,73.03 9.21,73.03 9.21,71.12 R26.1
N$36  (via drill 0.35)
  Top 0.254: v33.02,70.17 35.56,72.71 35.56,83.82 IC1.21
  Bottom 0.254: v33.02,70.17 19.68,70.17 19.05,69.53 10.16,69.53 9.21,68.58 R27.1
N$38  (via drill 0.35)
  Top 0.254: v4.13,40.01 4.13,41.59 IC2.18 | v37.78,39.37 38.1,39.05 38.1,36.83 R17.2 38.42,36.83 38.42,34.92 40.32,33.02 R15.1
  Bottom 0.254: v4.13,40.01 4.76,39.37 v37.78,39.37
N$48  (via drill 0.35)
  Top 0.254: v10.48,37.15 7.94,39.69 7.94,41.59 IC2.24 | v37.78,31.75 38.73,30.8 38.73,26.99 40.32,25.4 R11.1
  Bottom 0.254: v10.48,37.15 10.79,37.47 27.62,37.47 33.34,31.75 v37.78,31.75
N$49  (via drill 0.35)
  Top 0.254: 58.74,26.67 58.74,24.13 PORT22.A | 58.74,31.75 58.74,29.21 | 58.74,31.75 58.74,34.29 ACT.A 58.42,34.29 v57.15,35.56 | 58.74,31.75 PORT33.C | v6.35,37.78 6.67,38.1 6.67,41.59 IC2.22 | 58.74,29.21 58.74,26.67 | 58.74,26.67 PORT11.A | 58.74,29.21 PORT44.C
  Bottom 0.254: v6.35,37.78 6.67,38.1 27.94,38.1 30.48,35.56 v57.15,35.56
PIC_LED1  (via drill 0.35)
  Top 0.254: v11.11,72.07 9.53,73.66 v9.53,85.41
  Bottom 0.254: v11.11,72.07 11.43,72.07 12.38,71.12 R9.1 | v9.53,85.41 8.57,86.36 JP1.3
PIC_LED2
  Bottom 0.254: JP1.4 R5.1
PIC_RST  (via drill 0.35)
  Top 0.254: v17.78,68.58 19.05,69.85 19.05,72.71 | IC1.1 19.05,72.71 | v20,88.9 22.86,86.04 22.86,83.5 21.27,81.92 21.27,80.01 22.86,78.42 22.86,76.52 19.05,72.71
  Bottom 0.254: v17.78,68.58 16.83,68.58 15.56,67.31 R4.2 | JP1.1 5.08,88.9 v20,88.9
PWR
  Top 0.254: BUTTOM.2 BUTTOM.1
RIGHT_PC5
  Top 0.254: BUTTOM.16 BUTTOM.15
RST_PD7
  Top 0.254: TOP_HEADER.17 27.94,93.98 27.94,76.52 27.3,75.88 27.3,52.39 26.99,52.07 T4.1
SCL
  Bottom 0.254: JP1.9 R26.2
SDA
  Bottom 0.254: JP1.10 R27.2
T_CLK
  Top 0.254: BUTTOM.22 BUTTOM.21
T_MISO
  Top 0.254: U5.16 55.24,52.39 55.56,52.7 55.56,56.2 56.83,57.47 56.83,61.28 58.1,62.55 59.69,62.55 59.69,10.16 55.88,6.35 34.29,6.35 BUTTOM.24 BUTTOM.23
T_MOSI  (via drill 0.35)
  Top 0.254: v53.66,51.44 54.93,51.44 U5.15 | BUTTOM.26 BUTTOM.25
  Bottom 0.254: v53.66,51.44 58.74,46.35 58.74,6.35 38.1,6.35 BUTTOM.26
T_RST  (via drill 0.35)
  Top 0.254: v56.52,54.61 56.52,50.8 55.24,50.8 U5.14 | v45.09,49.85 36.83,41.59 36.83,10.48 32.7,6.35 29.21,6.35 BUTTOM.20 BUTTOM.19
  Bottom 0.254: v56.52,54.61 54.29,52.39 47.62,52.39 v45.09,49.85
UP_PC4
  Top 0.254: BUTTOM.12 BUTTOM.11
VCC  (via drill 0.35)
  Top 0.254: TOP_HEADER.1 8.57,93.03 8.57,87 | 8.57,87 8.57,71.12 v11.11,68.58 | v5.4,43.81 5.4,41.91 IC2.20 | 35.56,15.24 35.56,11.43 C8.1 | 35.56,15.24 35.56,36.83 | 35.56,15.24 C2.1 | IC1.20 40.64,83.82 40.64,46.35 v35.56,41.27 35.56,36.83 | 35.56,36.83 R17.1 | v12.38,87 8.57,87
  Bottom 0.254: L1.2 21.59,61.28 11.43,61.28 T8.2 11.11,61.59 10.16,61.59 10.16,65.09 12.38,67.31 | 12.38,67.31 v11.11,68.58 | 12.38,67.31 R4.1 | 32.07,43.81 v5.4,43.81 | 32.07,43.81 32.7,43.18 C10.2 33.02,43.18 34.92,41.27 v35.56,41.27 | 32.07,43.81 32.07,46.99 C9.+ | v12.38,87 37.47,87 IC1.20
VCC_PB7
  Top 0.254: TOP_HEADER.27 39.37,94.93 38.1,93.66 38.1,89.22 T3.1
VDD
  Bottom 0.254: C7.2 34.29,50.8 34.29,53.34 R23.2 17.46,53.34 9.21,61.59 9.21,62.23 T8.1 8.89,62.55 8.89,66.99 8.57,66.99 7.3,68.26 7.3,73.66 JP1.8
VPP  (via drill 0.35)
  Top 0.254: v26.67,16.83 32.38,22.54 v32.38,54.29 31.43,55.24 31.43,73.34 v31.11,73.66
  Bottom 0.254: v26.67,16.83 24.77,16.83 21.91,13.97 T10.1 | v32.38,54.29 35.24,57.15 R22.2 | JP1.5 3.49,80.33 6.67,80.33 7.94,79.06 7.94,73.66 v31.11,73.66
WIFI_BLE
  Top 0.254: U6.3 8.57,31.43 9.53,30.48 9.53,5.71 BUTTOM.4 BUTTOM.3 | 50.8,43.81 50.48,44.13 50.48,45.09 U5.4 | 50.8,43.81 52.07,43.81 52.07,45.09 U5.6 52.07,45.4 52.07,52.07 52.7,52.7 52.7,53.66 U5.18 52.7,53.98 52.7,54.93 43.18,64.45 43.18,96.52 38.73,96.52 38.1,95.89 38.1,94.61 37.47,93.98 37.47,91.44 T3.2 | 50.48,35.24 50.8,35.56 50.8,43.81 | 50.48,35.24 49.53,34.29 C1.2 | SV1.5 50.16,22.23 50.16,29.21 50.48,29.53 50.48,35.24
  Bottom 0.254: BUTTOM.4 13.34,9.53 40.32,9.53 47.62,16.83 47.62,20.32 SV1.5